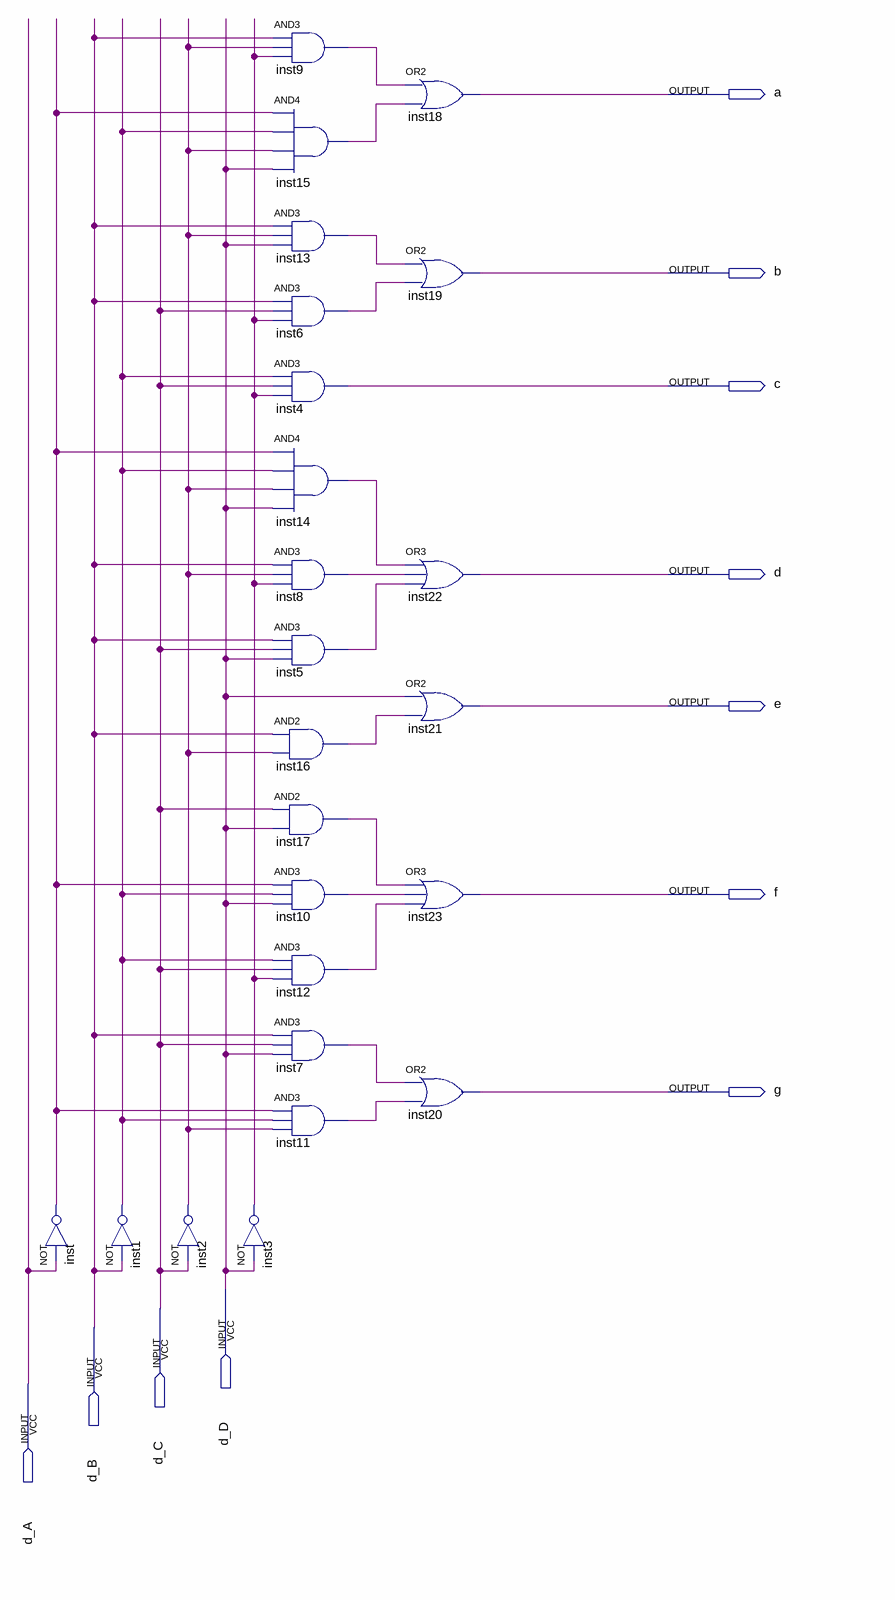
[diagram p0: schematic sheet]
// Quartus schematic decodificadorp1.bdf as structural Verilog: 24 symbols, 11 pins
module decodificadorp1 (
  input  d_D,
  input  d_C,
  input  d_B,
  input  d_A,
  output a,
  output b,
  output c,
  output d,
  output e,
  output f,
  output g
);

  wire inst1_out, inst2_out, inst3_out, inst5_out, inst6_out, inst7_out, inst8_out, inst9_out, inst10_out,
       inst11_out, inst12_out, inst13_out, inst14_out, inst15_out, inst16_out, inst17_out, inst_out;

  not inst (inst_out, d_A);
  not inst1 (inst1_out, d_B);
  not inst3 (inst3_out, d_D);
  not inst2 (inst2_out, d_C);
  and inst9 (inst9_out, d_B, inst2_out, inst3_out);
  and inst15 (inst15_out, inst_out, inst1_out, inst2_out, d_D);
  and inst13 (inst13_out, d_B, inst2_out, d_D);
  and inst6 (inst6_out, d_B, d_C, inst3_out);
  and inst4 (c, inst1_out, d_C, inst3_out);
  and inst14 (inst14_out, inst_out, inst1_out, inst2_out, d_D);
  and inst8 (inst8_out, d_B, inst2_out, inst3_out);
  and inst5 (inst5_out, d_B, d_C, d_D);
  and inst16 (inst16_out, d_B, inst2_out);
  and inst17 (inst17_out, d_C, d_D);
  and inst10 (inst10_out, inst_out, inst1_out, d_D);
  and inst12 (inst12_out, inst1_out, d_C, inst3_out);
  and inst7 (inst7_out, d_B, d_C, d_D);
  and inst11 (inst11_out, inst_out, inst1_out, inst2_out);
  or inst18 (a, inst9_out, inst15_out);
  or inst19 (b, inst13_out, inst6_out);
  or inst22 (d, inst14_out, inst8_out, inst5_out);
  or inst21 (e, d_D, inst16_out);
  or inst23 (f, inst17_out, inst10_out, inst12_out);
  or inst20 (g, inst7_out, inst11_out);
endmodule
